# EAGLE design Bare_ESP32 (EAGLE 9.5.2)
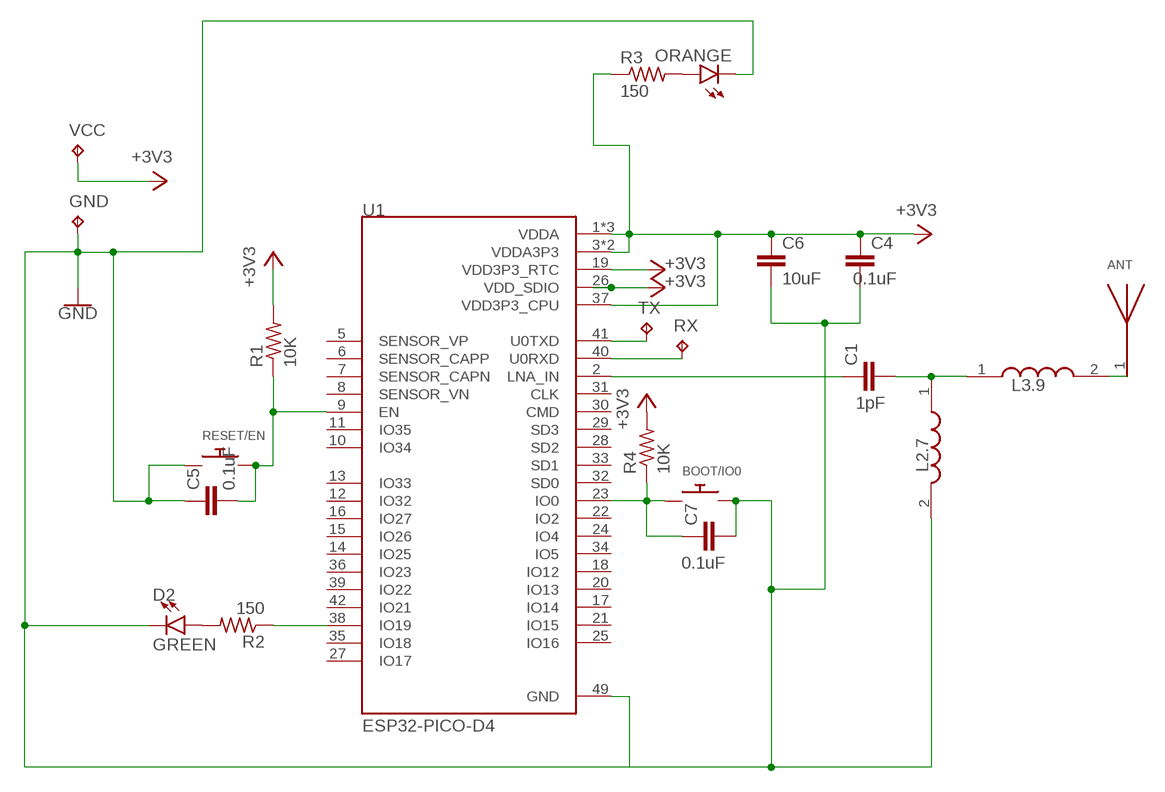
[diagram p0: schematic, sheet 1]

## Parts
ANT  2450AT18A100E  [ANTC3216X140N]
BOOT/IO0  SWITCH_PUSHBUTTONEVQ-PE  [TACT_PANA-EVQ]
C1  1pF  0.1UF-0402-16V-10%  [0402]
C4  0.1uF  0.1UF-0402-16V-10%  [0402]
C5  0.1uF  0.1UF-0402-16V-10%  [0402]
C6  10uF  0.1UF-0402-16V-10%  [0402]
C7  0.1uF  0.1UF-0402-16V-10%  [0402]
D2  GREEN  LED-GREEN1206  [LED-1206]
GND  TPTP14SQ  [TP14SQ]
L2.7  2.7nH  L-07C2N7SV6T  [INDC1005X60N]
L3.9  3.9nH  L-07C2N7SV6T  [INDC1005X60N]
ORANGE  LED-ORANGE0603  [0603-ORANGE]
R1  10K  R-US_R0402  [R0402]
R2  150  R-US_R0402  [R0402]
R3  150  R-US_R0402  [R0402]
R4  10K  R-US_R0402  [R0402]
RESET/EN  SWITCH_PUSHBUTTONEVQ-PE  [TACT_PANA-EVQ]
RX  TPTP14SQ  [TP14SQ]
TX  TPTP14SQ  [TP14SQ]
U1  ESP32-PICO-D4  [PQFN50P700X700X104-49N]
VCC  TPTP14SQ  [TP14SQ]

## Nets
+3V3: C4.1 C6.1 R1.2 R3.1 R4.2 U1.1(VDDA) U1.3(VDDA3P3) U1.4(VDDA3P3) U1.19(VDD3P3_RTC) U1.26(VDD_SDIO) U1.37(VDD3P3_CPU) U1.43(VDDA) U1.46(VDDA) VCC.TP
GND: BOOT/IO0.P$2 C4.2 C5.1 C6.2 C7.2 D2.C GND.TP L2.7.2 ORANGE.C RESET/EN.P$1 U1.49(GND)
N$1: C1.2 L2.7.1 L3.9.1
N$2: ORANGE.A R3.2
N$3: BOOT/IO0.P$1 C7.1 R4.1 U1.23(IO0)
N$4: C1.1 U1.2(LNA_IN)
N$5: C5.2 R1.1 RESET/EN.P$2 U1.9(EN)
N$7: ANT.1 L3.9.2
N$8: D2.A R2.2
N$9: R2.1 U1.38(IO19)
N$10: TX.TP U1.41(U0TXD)
N$11: RX.TP U1.40(U0RXD)
Unconnected: U1.5(SENSOR_VP) U1.6(SENSOR_CAPP) U1.7(SENSOR_CAPN) U1.8(SENSOR_VN) U1.10(IO34) U1.11(IO35) U1.12(IO32) U1.13(IO33) U1.14(IO25) U1.15(IO26) U1.16(IO27) U1.17(IO14) U1.18(IO12) U1.20(IO13) U1.21(IO15) U1.22(IO2) U1.24(IO4) U1.25(IO16) U1.27(IO17) U1.28(SD2) U1.29(SD3) U1.30(CMD) U1.31(CLK) U1.32(SD0) U1.33(SD1) U1.34(IO5) U1.35(IO18) U1.36(IO23) U1.39(IO22) U1.42(IO21)

## Library data of the parts
ANT = SMT_small_antenna:2450AT18A100E: ANTENNA, CERAMIC, 2.45GHZ; Bandwidth: 100MHz; Frequency: 2.45GHz; Gain: -0.5dB; Impedance: 50ohm; AVAILABILITY: Unavailable; DESCRIPTION: 2.4GHz Chip RF Antenna 2.4GHz ~ 2.5GHz 0.5dBi Solder Surface Mount; MF: Johanson Technology; MP: 2450AT18A100E; PACKAGE: FBGA-780 Johanson; PRICE: None
BOOT/IO0 RESET/EN = adafruit:SWITCH_PUSHBUTTON: Buttons SOFTTOUCHSMD_SJ - Soft touch temporary push button (Super Junk Akihabara) Compatible with SKPMANE010 [Mouser: 688-SKPMAN] C&K_KSS = Digikey: KSS221GLFS
C1 C6 = SparkFun-Capacitors:0.1UF: 0.1µF ceramic capacitors A capacitor is a passive two-terminal electrical component used to store electrical energy temporarily in an electric field.; PROD_ID: CAP-12416; VALUE: 0.1uF
C4 C5 C7 = SparkFun-Capacitors:0.1UF: 0.1µF ceramic capacitors A capacitor is a passive two-terminal electrical component used to store electrical energy temporarily in an electric field.; PROD_ID: CAP-12416
D2 = SparkFun-LED:LED-GREEN: Green SMD LED Used in manufacturing of various products at SparkFun Packages: 0603 - SMD 0603 package [Product Link] <http://www.futureelectronics.com/en/technologies/semiconductors/optoelectronics/leds/Pages/9894312-LTST-C190GKT.aspx?CrossPart=HSMG-C190&IM=0> LilyPad 1206 - SMD1206 LilyPad package [Product Link] <http://www.futureelectronics.com/en/Technologies/Product.aspx?ProductID=IN150NGHARVATEKCORPORATION2049943&IM=0> 1206 - SMD1206 package [Product Link] <http://www.futureelectronics.com/en/technologies/semiconductors/optoelectronics/leds/Pages/8315665-LTST-C150KGKT.aspx?IM=0> 1206 Bottom Mount -SMD 1206 Bottom Mount [Product Link] <http://www.digikey.com/product-detail/en/lite-on-inc/LTST-C230KGKT/160-1456-1-ND/386854> SparkFun Products: Pro Mini 328 -5V <https://www.sparkfun.com/products/821> RedBoard <https://www.sparkfun.com/products/12757> MP3 Trigger <https://www.sparkfun.com/products/13720> Makey Makey <https://www.sparkfun.com/products/11076>; PROD_ID: DIO-00862
GND RX TX VCC = testpad:TP: Test pad
L2.7 L3.9 = L-07C2N7SV6T:L-07C2N7SV6T: JOHANSON TECHNOLOGY - L-07C2N7SV6T - INDUCTOR RF, 2.7NH, +/-0.3NH, 0402 Source: Datasheet <https://www.johansontechnology.com/downloads/jti-cat-rf-ind.pdf>; DESCRIPTION: JOHANSON TECHNOLOGY - L-07C2N7SV6T - INDUCTOR RF, 2.7NH, +/-0.3NH, 0402; HEIGHT: 0.6mm; MANUFACTURER_NAME: JOHANSON TECHNOLOGY; MANUFACTURER_PART_NUMBER: L-07C2N7SV6T; MOUSER_PART_NUMBER: 609-L-07C2N7SV6T; MOUSER_PRICE-STOCK: https://www.mouser.com/Search/Refine.aspx?Keyword=609-L-07C2N7SV6T
ORANGE = BeagleBone_Blue_R3:LED-ORANGE
R1-R4 = resistor:R-US_: RESISTOR, American symbol
U1 = ESP32-PICO-D4:ESP32-PICO-D4: The ESP32-PICO-D4 is a System-in-Package (SIP) module that is based on ESP32, providing complete Wi-Fi and Bluetooth functionalities. The module has a size as small as 7.0±0.1 mm×7.0±0.1 mm×0.94±0.1 mm, thus requiring minimal PCB area. The module integrates a 4-MB SPI flash; AVAILABILITY: Unavailable; DESCRIPTION: WIFi/Bluetooth SIP; MF: Espressif Systems; MP: ESP32-PICO-D4; PACKAGE: SMD-48 Espressif Systems; PRICE: None

## Board
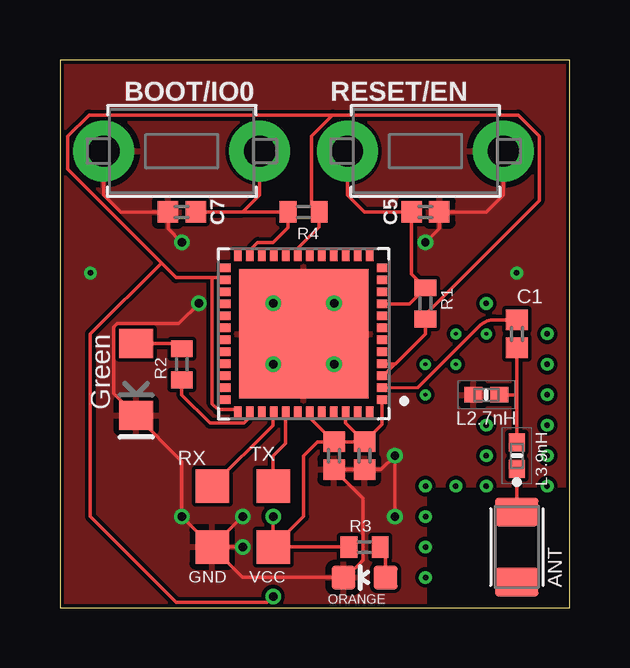
[diagram p1: board, top side]
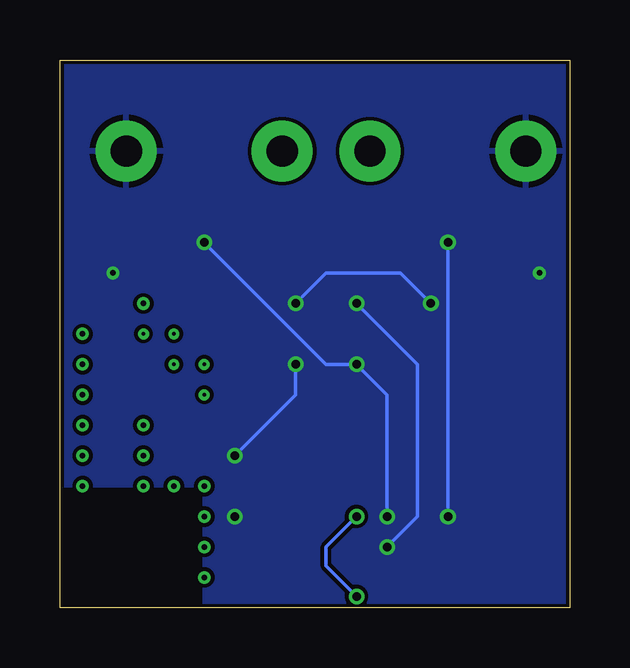
[diagram p2: board, bottom side, seen from below]

Size 21.26 x 22.85 mm. Coordinates in mm from the lower left corner, seen from the top.
Outline: 0,0 21.26,0 21.26,22.85 0,22.85 0,0
Copper layers (1*16): Top 0.035mm / dielectric 1.5mm / Bottom 0.035mm
Design rules "default *": minimum track width 6mil, minimum drill 0.35mm, track to track 6mil, track to pad 6mil, pad to pad 6mil, via to via 6mil, smd to smd 6mil, copper to edge 6mil, drill to drill 6mil, minimum pad ring 10mil, minimum via ring 6mil, stop-mask expansion 4mil, vias tented up to drill 0mil, thermal gap 10mil

### Footprints (pad centres in the part's own frame; a part is rotated, then mirrored left to right if it is on the bottom)
ANTC3216X140N = smd 1.2 x 1.82: 1 -1.46,0; 2 1.46,0
TACT_PANA-EVQ = drill 1.3 pad 2.54: P$1 -3.25,0; P$2 3.25,0
0402 = smd 0.85 x 0.9: 1 -0.58,0; 2 0.58,0
LED-1206 = smd 1.2 x 1.4: A -1.5,0; C 1.5,0
TP14SQ = smd 1.4 x 1.4: TP 0,0
INDC1005X60N = smd 0.75 x 0.65: 1 -0.55,0; 2 0.55,0
0603-ORANGE = smd 1 x 1: A 0,-0.877; C 0,0.877
R0402 = smd 0.7 x 0.9: 1 -0.65,0; 2 0.65,0
PQFN50P700X700X104-49N = smd 0.45 x 0.35: 1 -3.265,2.75; 2 -3.265,2.25; 3 -3.265,1.75; 4 -3.265,1.25; 5 -3.265,0.75; 6 -3.265,0.25; 7 -3.265,-0.25; 8 -3.265,-0.75; 9 -3.265,-1.25; 10 -3.265,-1.75; 11 -3.265,-2.25; 12 -3.265,-2.75; 25 3.265,-2.75; 26 3.265,-2.25; 27 3.265,-1.75; 28 3.265,-1.25; 29 3.265,-0.75; 30 3.265,-0.25; 31 3.265,0.25; 32 3.265,0.75; 33 3.265,1.25; 34 3.265,1.75; 35 3.265,2.25; 36 3.265,2.75 | smd 0.35 x 0.45: 13 -2.75,-3.265; 14 -2.25,-3.265; 15 -1.75,-3.265; 16 -1.25,-3.265; 17 -0.75,-3.265; 18 -0.25,-3.265; 19 0.25,-3.265; 20 0.75,-3.265; 21 1.25,-3.265; 22 1.75,-3.265; 23 2.25,-3.265; 24 2.75,-3.265; 37 2.75,3.265; 38 2.25,3.265; 39 1.75,3.265; 40 1.25,3.265; 41 0.75,3.265; 42 0.25,3.265; 43 -0.25,3.265; 44 -0.75,3.265; 45 -1.25,3.265; 46 -1.75,3.265; 47 -2.25,3.265; 48 -2.75,3.265 | smd 5.4 x 5.4: 49 0,0

### Placement (x,y rotation side)
ANT  19.05,2.54 270 top
BOOT/IO0  5.08,19.05 180 top
C1  19.05,11.43 270 top
C4  11.43,6.35 270 top
C5  15.24,16.51 180 top
C6  12.7,6.35 270 top
C7  5.08,16.51 180 top
D2  3.17,9.53 270 top
GND  6.35,2.54 0 top
L2.7  17.78,8.89 180 top
L3.9  19.05,6.35 270 top
ORANGE  12.7,1.27 90 top
R1  15.24,12.7 270 top
R2  5.08,10.16 90 top
R3  12.7,2.54 0 top
R4  10.16,16.51 0 top
RESET/EN  15.24,19.05 180 top
RX  6.35,5.08 0 top
TX  8.89,5.08 0 top
U1  10.16,11.43 180 top
VCC  8.89,2.54 0 top

### Tracks (layer width: path | path; a pad name or v marks a point on that pad's centre or on a via)
+3V3  (via drill 0.35)
  Top 0.152: C4.1 C6.1 | 11.37,20.55 10.49,19.67 10.49,16.83 R4.2 10.81,15.89 9.91,14.99 U1.19 | U1.26 6.8,13.78 6.35,13.78 | 6.35,13.78 4.84,13.78 4.23,14.39 | 4.23,14.39 0.33,18.29 0.33,19.67 1.21,20.55 11.37,20.55 | VCC.TP 10.16,3.81 10.16,6.35 10.74,6.93 C4.1 | R3.1 VCC.TP | C4.1 10.41,7.95 U1.43 | U1.46 11.91,7.72 C6.1 | U1.37 7.3,8.28 6.59,8.28 6.35,8.51 6.35,13.78 | C6.1 13.42,7.66 U1.1 | 11.37,20.55 19.11,20.55 19.99,19.67 19.99,16.98 15.24,12.23 R1.2 15.24,11.43 13.99,10.18 13.97,10.18 | 4.23,14.39 1.27,11.43 1.27,3.81 4.85,0.23 8.64,0.23 v8.89,0.48 | v8.89,3.81 VCC.TP | 13.97,10.18 U1.4 | U1.3 13.47,9.68 13.97,10.18
  Bottom 0.152: v8.89,0.48 10.16,1.75 10.16,2.54 v8.89,3.81
GND  (via drill 0.23, 0.35)
  Top 0.152: GND.TP 7.62,1.27 ORANGE.C 11.9,1.27 12.63,2 12.63,4.57 C4.2 C6.2 13.39,5.77 v13.97,6.35 v13.97,3.81 | GND.TP v5.08,3.81 5.08,6.12 D2.C 2.25,8.95 2.25,11.72 2.38,11.85 4.95,11.85 v5.79,12.7 | RESET/EN.P$1 18.49,17.22 17.78,16.51 C5.1 15.82,15.82 v15.24,15.24 | BOOT/IO0.P$2 1.83,17.22 2.54,16.51 C7.2 4.5,15.82 v5.08,15.24 | GND.TP v7.62,3.81 | U1.49 v8.89,10.16 | GND.TP v7.62,2.54 | U1.49 v11.43,12.7 | v8.89,12.7 U1.49 | v11.43,10.16 U1.49
  Bottom 0.152: v7.62,3.81 7.62,8.89 v8.89,10.16 10.16,10.16 v15.24,15.24 | v5.08,15.24 v5.08,3.81 | v8.89,12.7 6.35,10.16 6.35,3.81 v7.62,2.54 | v13.97,6.35 11.43,8.89 v11.43,10.16 | v5.79,12.7 7.06,13.97 10.16,13.97 v11.43,12.7
  other vias: 19.05,13.97 1.27,13.97
  pour Top: 0,22.86 21.59,22.86 21.59,5.08 15.24,5.08 15.24,0 0,0
  pour Bottom: 0,22.86 21.59,22.86 21.59,5.08 15.24,5.08 15.24,0 0,0
N$1
  Top 0.152: 19.05,8.89 L3.9.1 | 18.36,8.89 L2.7.1 19.05,8.89 | C1.2 19.05,8.89
N$2
  Top 0.152: R3.2 13.58,2.31 ORANGE.A
N$3
  Top 0.152: BOOT/IO0.P$1 8.33,17.22 7.62,16.51 | C7.1 7.62,16.51 | 7.62,16.51 R4.1 9.51,15.86 8.89,15.24 8.24,15.24 8.01,15.01 8.01,14.79 U1.23
N$4
  Top 0.152: C1.1 18.12,12.01 arc45 17.47,11.74 14.93,9.2 U1.2
N$5
  Top 0.152: RESET/EN.P$2 11.99,17.22 12.7,16.51 C5.2 14.66,13.93 R1.1 14.57,12.68 U1.9
N$6  (via drill 0.23)
  other vias: 15.24,5.08
N$7
  Top 0.152: L3.9.2 ANT.1
N$8
  Top 0.152: D2.A 4.87,11.03 R2.2
N$9
  Top 0.152: U1.38 7.81,8.07 7.81,7.86 7.67,7.71 6.26,7.71 5.08,8.89 R2.1
N$10
  Top 0.152: U1.41 9.41,6.87 8.89,6.35 TX.TP
N$11
  Top 0.152: U1.40 8.89,8.14 8.89,7.62 RX.TP
N$12  (via drill 0.23)
  other vias: 15.24,3.81
N$13  (via drill 0.23)
  other vias: 15.24,2.54
N$14  (via drill 0.23)
  other vias: 15.24,1.27
N$15  (via drill 0.23)
  other vias: 17.78,5.08
N$16  (via drill 0.23)
  other vias: 17.78,6.35
N$17  (via drill 0.23)
  other vias: 17.78,7.62
N$18  (via drill 0.23)
  other vias: 20.32,8.89
N$19  (via drill 0.23)
  other vias: 20.32,10.16
N$20  (via drill 0.23)
  other vias: 20.32,11.43
N$21  (via drill 0.23)
  other vias: 20.32,7.62
N$22  (via drill 0.23)
  other vias: 20.32,6.35
N$23  (via drill 0.23)
  other vias: 20.32,5.08
N$24  (via drill 0.23)
  other vias: 16.51,5.08
N$25  (via drill 0.23)
  other vias: 17.78,12.7
N$26  (via drill 0.15)
  other vias: 16.51,11.43
N$27  (via drill 0.15)
  other vias: 17.78,11.43
N$28  (via drill 0.15)
  other vias: 15.24,8.89
N$29  (via drill 0.15)
  other vias: 15.24,10.16
N$30  (via drill 0.15)
  other vias: 16.51,10.16

### Text on the board
tNames: C1 | Green | L2.7nH | L3.9nH